# Altium schematic sheet UWB_Positioning.SchDoc
size A4; DocumentNumber: 4; SheetNumber: 4; SheetTotal: 7
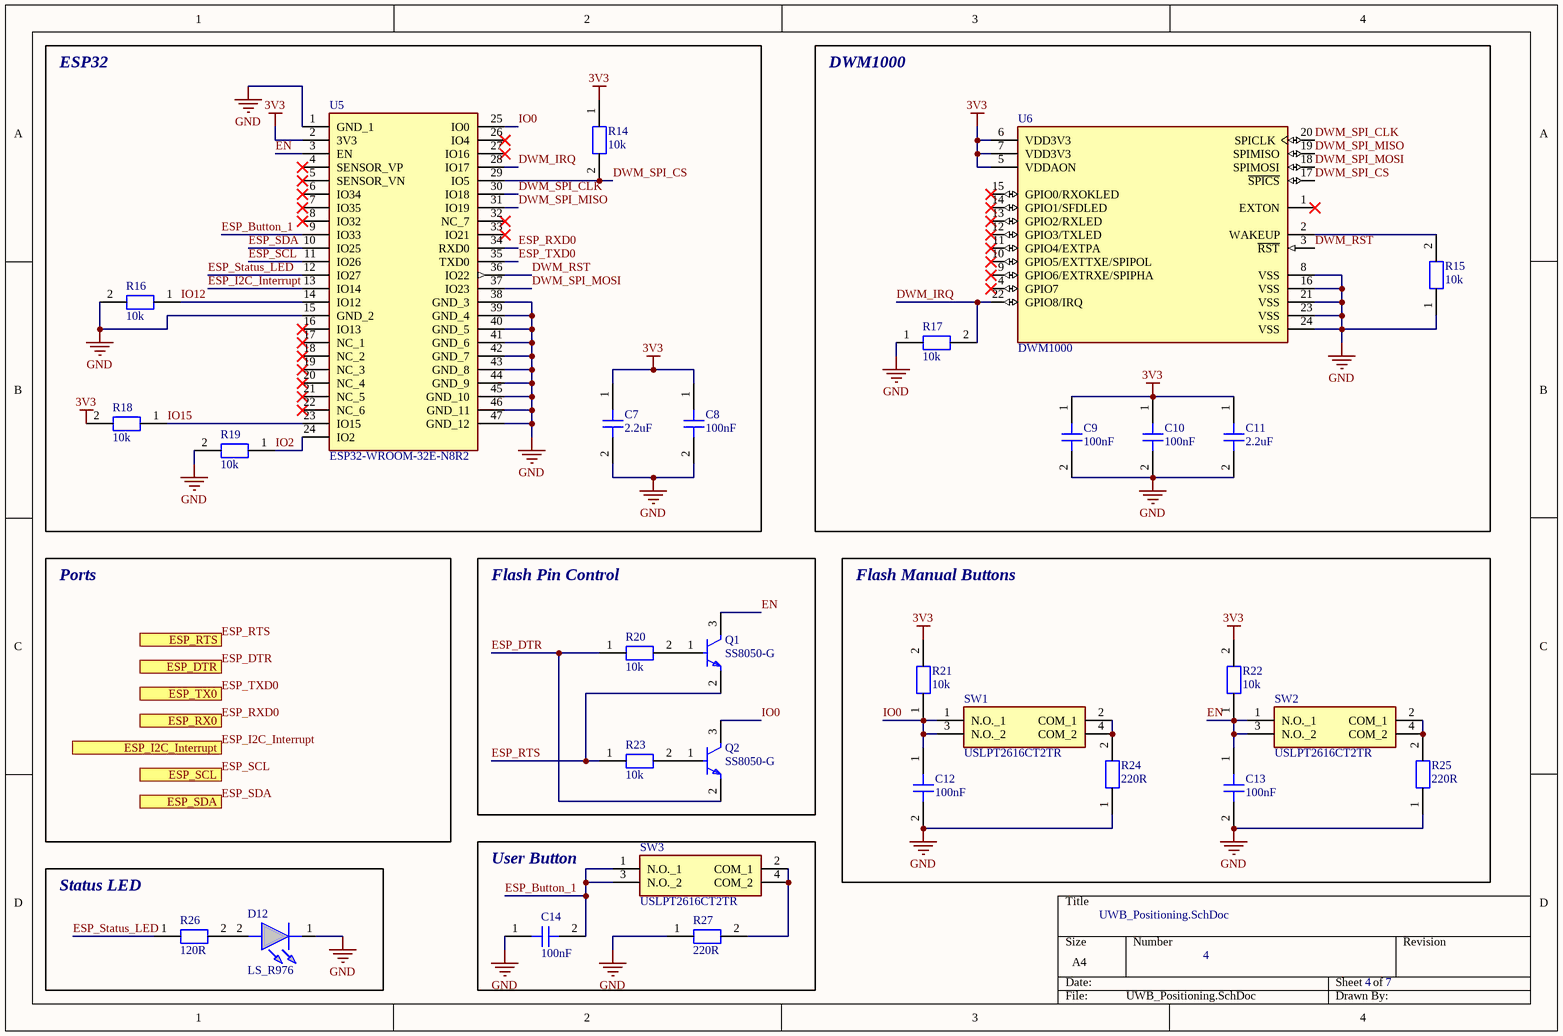
[diagram p0: UWB_Positioning.SchDoc]

## Parts
C7  2.2uF  [Cap_0603_Medium_Density]
C8  100nF  [Cap_0603_Medium_Density]
C9  100nF  [Cap_0603_Medium_Density]
C10  100nF  [Cap_0603_Medium_Density]
C11  2.2uF  [Cap_0603_Medium_Density]
C12  100nF  [Cap_0603_Medium_Density]
C13  100nF  [Cap_0603_Medium_Density]
C14  100nF  [Cap_0603_Medium_Density]
D12  LS_R976  [LEDC2012X40N]
Q1  SS8050-G  [FP-SS8050-G-MFG]
Q2  SS8050-G  [FP-SS8050-G-MFG]
R14  10k  [Res_0603_Medium_Density]
R15  10k  [Res_0603_Medium_Density]
R16  10k  [Res_0603_Medium_Density]
R17  10k  [Res_0603_Medium_Density]
R18  10k  [Res_0603_Medium_Density]
R19  10k  [Res_0603_Medium_Density]
R20  10k  [Res_0603_Medium_Density]
R21  10k  [Res_0603_Medium_Density]
R22  10k  [Res_0603_Medium_Density]
R23  10k  [Res_0603_Medium_Density]
R24  220R  [Res_0603_Medium_Density]
R25  220R  [Res_0603_Medium_Density]
R26  120R  [Res_0603_Medium_Density]
R27  220R  [Res_0603_Medium_Density]
SW1  USLPT2616CT2TR  [USLPT2616CT2TR]
SW2  USLPT2616CT2TR  [USLPT2616CT2TR]
SW3  USLPT2616CT2TR  [USLPT2616CT2TR]
U5  ESP32-WROOM-32E-N8R2  [ESP32WROOM32EN8R2]
U6  DWM1000  [FP-DWM1000-MFG]

## Blocks framed on the sheet
ESP32: C7 C8 R14 R16 R18 R19 U5
DWM1000: C9-C11 R15 R17 U6
Flash Pin Control: Q1 Q2 R20 R23
Flash Manual Buttons: C12 C13 R21 R22 R24 R25 SW1 SW2
User Button: C14 R27 SW3
Status LED: D12 R26

## Ports
ESP_DTR (in), ESP_I2C_Interrupt (out), ESP_RTS (in), ESP_RX0 (in), ESP_SCL (in), ESP_SDA (in), ESP_TX0 (out)

## Nets
3V3: C7.1 C8.1 C9.1 C10.1 C11.1 R14.1 R18.2 R21.2 R22.2 U5.2(3V3) U6.5(VDDAON) U6.6(VDD3V3) U6.7(VDD3V3)
GND: C7.2 C8.2 C9.2 C10.2 C11.2 C12.2 C13.2 C14.1 D12.1(K) R15.1 R16.2 R17.1 R19.2 R24.1 R25.1 R27.1 U5.1(GND_1) U5.15(GND_2) U5.38(GND_3) U5.39(GND_4) U5.40(GND_5) U5.41(GND_6) U5.42(GND_7) U5.43(GND_8) U5.44(GND_9) U5.45(GND_10) U5.46(GND_11) U5.47(GND_12) U6.8(VSS) U6.16(VSS) U6.21(VSS) U6.23(VSS) U6.24(VSS)
DWM_IRQ: R17.2 U5.28(IO17) U6.22(GPIO8/IRQ)
DWM_RST: U5.36(IO22) U6.3(~{RST})
DWM_SPI_CLK: U5.30(IO18) U6.20(SPICLK)
DWM_SPI_CS: R14.2 U5.29(IO5) U6.17(~{SPICS})
DWM_SPI_MISO: U5.31(IO19) U6.19(SPIMISO)
DWM_SPI_MOSI: U5.37(IO23) U6.18(SPIMOSI)
EN: C13.1 Q1.3(C) R22.1 SW2.1(N.O._1) SW2.3(N.O._2) U5.3(EN)
ESP_Button_1: C14.2 SW3.1(N.O._1) SW3.3(N.O._2) U5.9(IO33)
ESP_DTR: Q2.2(E) R20.1 ; port ESP_DTR
ESP_I2C_Interrupt: U5.13(IO14) ; port ESP_I2C_Interrupt
ESP_RTS: Q1.2(E) R23.1 ; port ESP_RTS
ESP_RXD0: U5.34(RXD0) ; port ESP_RX0
ESP_SCL: U5.11(IO26) ; port ESP_SCL
ESP_SDA: U5.10(IO25) ; port ESP_SDA
ESP_Status_LED: R26.1 U5.12(IO27)
ESP_TXD0: U5.35(TXD0) ; port ESP_TX0
IO0: C12.1 Q2.3(C) R21.1 SW1.1(N.O._1) SW1.3(N.O._2) U5.25(IO0)
IO2: R19.1 U5.24(IO2)
IO12: R16.1 U5.14(IO12)
IO15: R18.1 U5.23(IO15)
NetD12_2: D12.2(A) R26.2
NetQ1_1: Q1.1(B) R20.2
NetQ2_1: Q2.1(B) R23.2
NetR15_2: R15.2 U6.2(WAKEUP)
NetR24_2: R24.2 SW1.2(COM_1) SW1.4(COM_2)
NetR25_2: R25.2 SW2.2(COM_1) SW2.4(COM_2)
NetR27_2: R27.2 SW3.2(COM_1) SW3.4(COM_2)

Not connected (* = marked no-connect by the designer): U5 4(SENSOR_VP)* 5(SENSOR_VN)* 6(IO34)* 7(IO35)* 8(IO32)* 16(IO13)* 17(NC_1)* 18(NC_2)* 19(NC_3)* 20(NC_4)* 21(NC_5)* 22(NC_6)* 26(IO4)* 27(IO16)* 32(NC_7)* 33(IO21)*; U6 1(EXTON)* 4(GPIO7)* 9(GPIO6/EXTRXE/SPIPHA)* 10(GPIO5/EXTTXE/SPIPOL)* 11(GPIO4/EXTPA)* 12(GPIO3/TXLED)* 13(GPIO2/RXLED)* 14(GPIO1/SFDLED)* 15(GPIO0/RXOKLED)*

## Notes on the sheet
- Ports

## Library data of the parts
C7 C11 = Capacitor_MLLC: Part Number: 06036G225ZAT2A; Supplier: Mouser; ComponentLink1Description: Online Store Link; ComponentLink1URL: *; Manufacturer: *; Value: 2.2uF; Voltage: *; Package: 0603
C8-C10 C12-C14 = Capacitor_MLLC: Part Number: CC0603KRX7R8BB104; Supplier: Mouser; ComponentLink1Description: Online Store Link; ComponentLink1URL: *; Manufacturer: *; Value: 100nF; Voltage: *; Package: 0603
D12 = LS_R976: Red 0805 CHIPLED LS R976N-R102 Osram Opto LS R976, CHIPLED 0805 Series Red LED, 633 nm, 2012 (0805), Rectangle Lens SMD Package; Manufacturer_Name: ams OSRAM; Manufacturer_Part_Number: LS R976; Geometry.Height: 0.4mm; Mouser Part Number: 720-LSR976D5178; Mouser Price/Stock: https://www.mouser.co.uk/ProductDetail/OSRAM-Opto-Semiconductors/LS-R976?qs=OIr7YF%252B2cWVTfzKl425Fkw%3D%3D; Datasheet Link: http://uk.rs-online.com/web/p/products/4974804; Part Number: LS R976; Supplier: Mouser
Q1 Q2 = CMP-20235-000001-1: NPN TRANSISTOR 1.5A 40V SOT-23 R; Transition Frequency: 100MHz; Max Breakdown Voltage: 25V; Collector Emitter Voltage (VCEO): 400mV; Max Power Dissipation: 300mW; Max Collector Current: 1.5A; Case/Package: TO-236-3; Packaging: Tape and Reel; RoHS Compliant: Yes; Mount: Surface Mount; Collector Emitter Breakdown Voltage: 25V; Part Number: SS8050-G; Supplier: Mouser
R14-R23 = Resistor_SMD: Part Number: CR0603AFX-1002EAS; Value: 10k; Manufacturer: *; Supplier: Mouser; Voltage: *; ComponentLink1Description: Online Store Link; ComponentLink1URL: *; Package: 0603
R24 R25 R27 = Resistor_SMD: Part Number: CR0603-JW-221ELF; Value: 220R; Manufacturer: *; Supplier: Mouser; Voltage: *; ComponentLink1Description: Online Store Link; ComponentLink1URL: *; Package: 0603
R26 = Resistor_SMD: Part Number: CR0603-JW-121ELF; Value: 120R; Manufacturer: *; Supplier: Mouser; Voltage: *; ComponentLink1Description: Online Store Link; ComponentLink1URL: *; Package: 0603
SW1-SW3 = USLPT2616CT2TR: Body Features: Actuator Profile Extended; Manufacturer_Name: TE Connectivity; Geometry.Height: 0.55mm; Manufacturer_Part_Number: USLPT2616CT2TR; Mouser Part Number: 506-USLPT2616CT2TR; Mouser Price/Stock: https://www.mouser.co.uk/ProductDetail/TE-Connectivity-Alcoswitch/USLPT2616CT2TR?qs=qSfuJ%252Bfl%2Fd725nA8XgU6qQ%3D%3D; Datasheet Link: https://www.te.com/commerce/DocumentDelivery/DDEController?Action=srchrtrv&DocNm=2337224-1&DocType=Data%20Sheet&DocLang=English&PartCntxt=2337224-1&DocFormat=pdf; Part Number: USLPT2616CT2TR; Supplier: Mouser
U5 = ESP32-WROOM-32E-N8R2: Multiprotocol Modules ESP32-WROOM-32E integrates ESP32-D0WD-V3, with higher stability and safety performance.; Manufacturer_Name: Espressif Systems; Geometry.Height: 3.25mm; Manufacturer_Part_Number: ESP32-WROOM-32E-N8R2; Mouser Part Number: 356-ESP32WRM32EN8R2; Mouser Price/Stock: https://www.mouser.co.uk/ProductDetail/Espressif-Systems/ESP32-WROOM-32E-N8R2?qs=By6Nw2ByBD0mvGJSS3Ohlw%3D%3D; Datasheet Link: https://www.espressif.com/sites/default/files/documentation/esp32-wroom-32e_esp32-wroom-32ue_datasheet_en.pdf; Part Number: ESP32-WROOM-32E-N8R2; Supplier: Mouser
U6 = CMP-231853-000001-1: RX TXRX MODULE 802.15.4 CHIP SMD; Part Number: DWM1000; Supplier: TME